# EAGLE design Cansat2019_3279_Container_v02 (EAGLE 7.3.0)
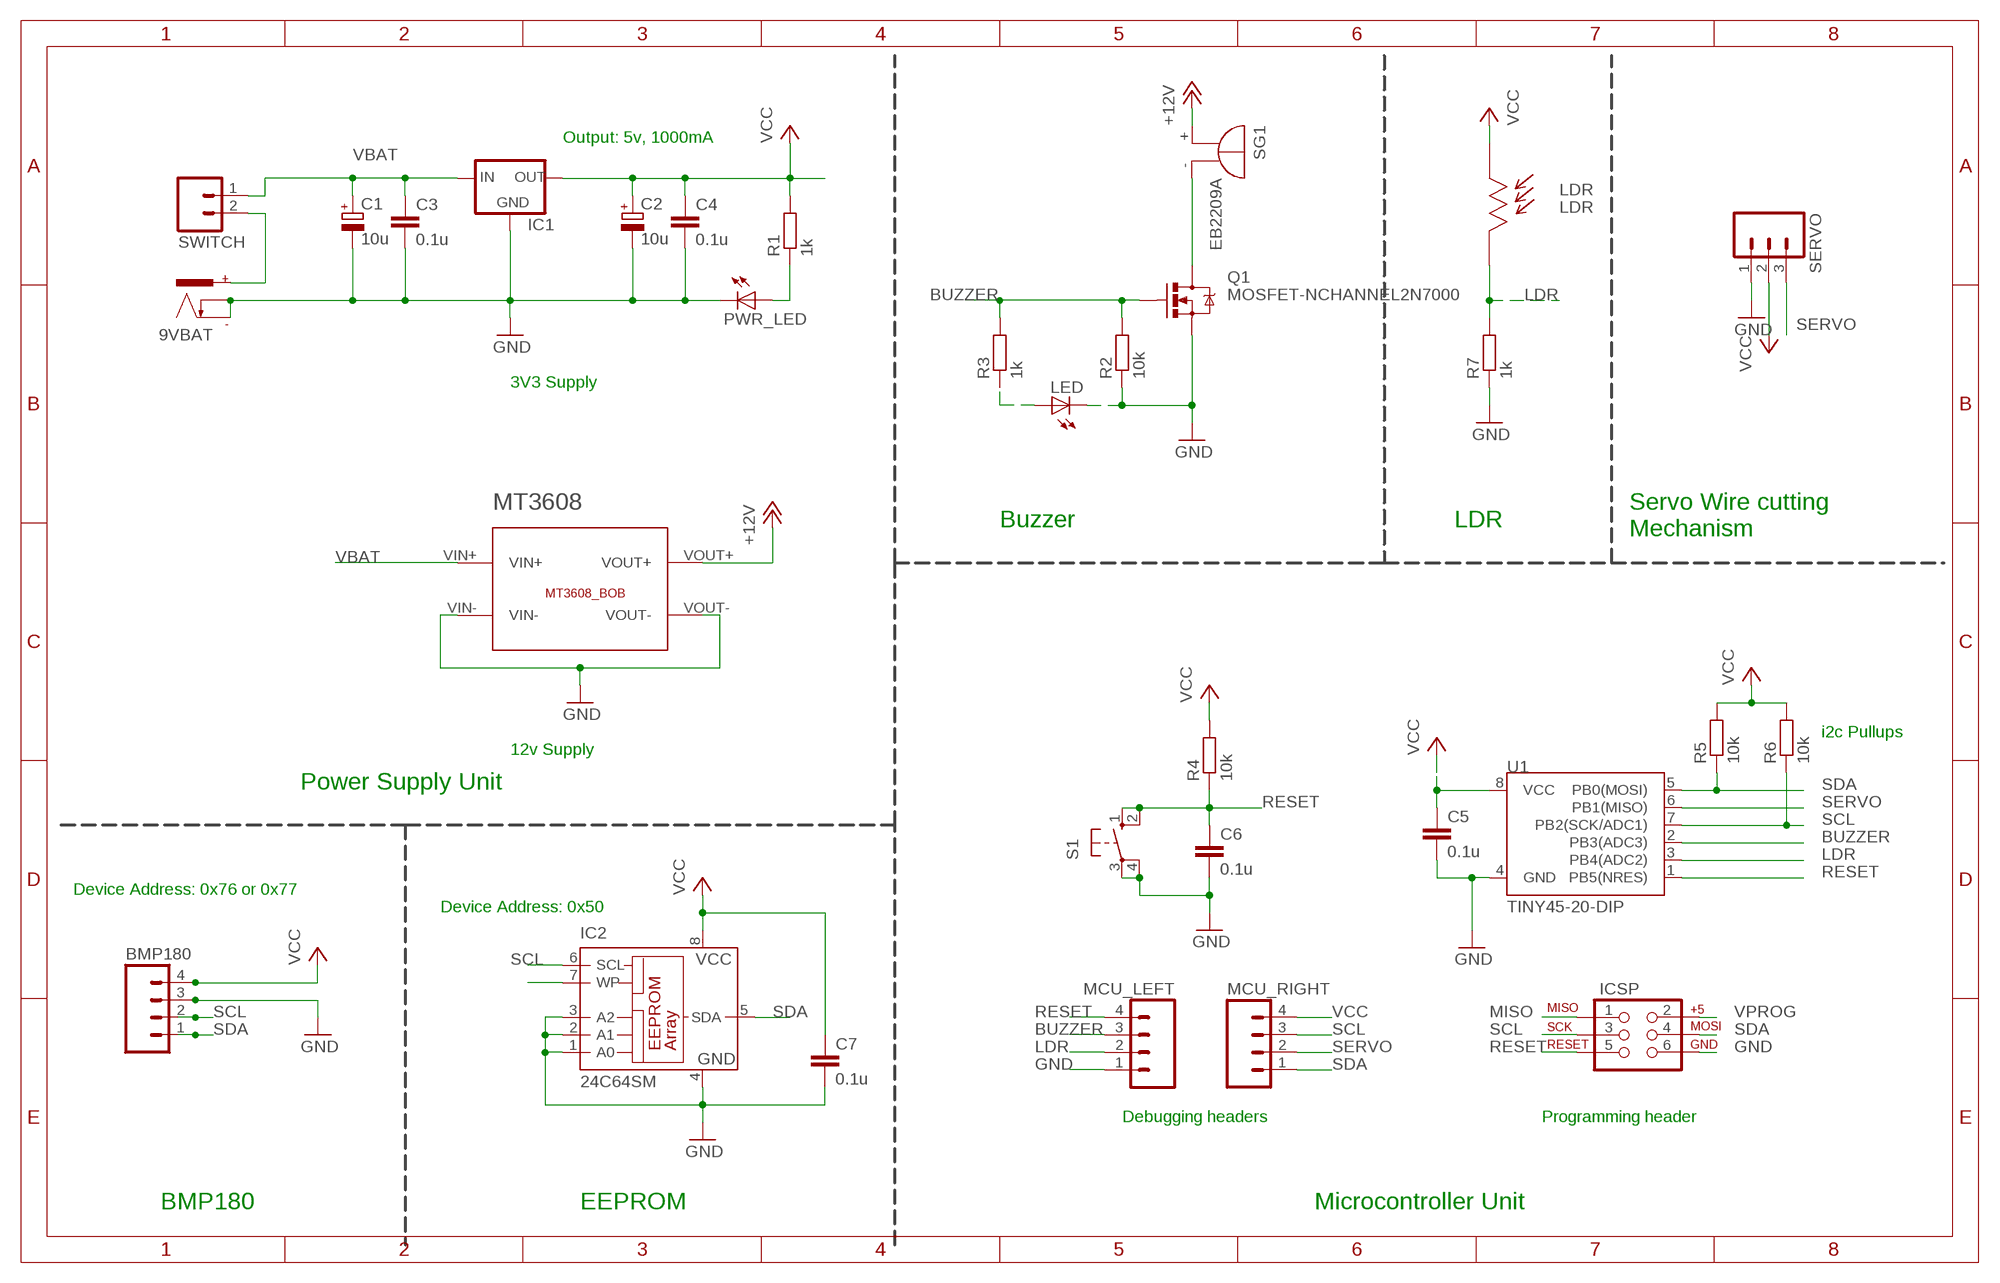
[diagram p0: schematic, sheet 1]

## Parts
9VBAT  POWER_CON  [NEB21R]
BMP180  M04  [04P]
C1  10u  CPOL-EUE2.5-6  [E2,5-6]
C2  10u  CPOL-EUE2.5-6  [E2,5-6]
C3  0.1u  C-EU025-025X050  [C025-025X050]
C4  0.1u  C-EU025-025X050  [C025-025X050]
C5  0.1u  C-EU025-025X050  [C025-025X050]
C6  0.1u  C-EU025-025X050  [C025-025X050]
C7  0.1u  C-EU025-025X050  [C025-025X050]
IC1  V_REG_78XX-TO-220  [TO-220-ALT]
IC2  24C64SM  [SO-08M]
ICSP  AVR_SPI_PRG_6NS  [2X3-NS]
LDR  LDR  [LDR-5MM]
LED  LED3MM  [LED3MM]
MCU_LEFT  M04  [04P]
MCU_RIGHT  M04  [04P]
MT3608  MT3608_BOB  [MT3608_BOB]
PWR_LED  LED3MM  [LED3MM]
Q1  MOSFET-NCHANNEL2N7000  [TO-92]
R1  1k  R-EU_0204/7  [0204/7]
R2  10k  R-EU_0204/7  [0204/7]
R3  1k  R-EU_0204/7  [0204/7]
R4  10k  R-EU_0204/7  [0204/7]
R5  10k  R-EU_0204/7  [0204/7]
R6  10k  R-EU_0204/7  [0204/7]
R7  1k  R-EU_0204/7  [0204/7]
S1  PUSH-BUTTON-6MM  [B3F-10XX]
SERVO  M03  [03P]
SG1  EB2209A  [EB2209A]
SWITCH  M02  [02P]
U1  TINY45-20-DIP  ATTINY45TINY45-20-DIP  [DIP08]

## Nets
+12V [power]: MT3608.VOUT+ SG1.+
BUZZER: MCU_LEFT.3 Q1.2(G) R2.2 R3.2 U1.2(PB3(ADC3))
GND [power]: 9VBAT.- 9VBAT.C BMP180.3 C1.- C2.- C3.2 C4.2 C5.2 C6.2 C7.2 IC1.GND IC2.1(A0) IC2.2(A1) IC2.3(A2) IC2.4(GND) ICSP.6 LED.K(C) MCU_LEFT.1 MT3608.VIN- MT3608.VOUT- PWR_LED.K(C) Q1.1(S) R2.1 R7.1 S1.3(P) S1.4(P1) SERVO.1 U1.4(GND)
LDR: LDR.P$2 MCU_LEFT.2 R7.2 U1.3(PB4(ADC2))
MISO: ICSP.1
N$1 [power]: Q1.3(D) SG1.-
N$2: LED.A R3.1
N$3: PWR_LED.A R1.1
N$6 [burner]: 9VBAT.+ SWITCH.2
N$8: IC2.7(WP)
RESET: C6.1 ICSP.5 MCU_LEFT.4 R4.1 S1.1(S) S1.2(S1) U1.1(PB5(NRES))
SCL: BMP180.2 IC2.6(SCL) ICSP.3 MCU_RIGHT.3 R6.1 U1.7(PB2(SCK/ADC1))
SDA: BMP180.1 IC2.5(SDA) ICSP.4 MCU_RIGHT.1 R5.1 U1.5(PB0(MOSI))
SERVO: MCU_RIGHT.2 SERVO.3 U1.6(PB1(MISO))
VBAT [burner]: C1.+ C3.1 IC1.IN MT3608.VIN+ SWITCH.1
VCC [power]: BMP180.4 C2.+ C4.1 C5.1 C7.1 IC1.OUT IC2.8(VCC) LDR.P$1 MCU_RIGHT.4 R1.2 R4.2 R5.2 R6.2 SERVO.2 U1.8(VCC)
VPROG [power]: ICSP.2

## Notes on the sheet
- Output: 5v, 1000mA
- 3V3 Supply
- Buzzer | LDR
- Servo Wire cutting
  Mechanism
- i2c Pullups
- 12v Supply
- Power Supply Unit
- Device Address: 0x76 or 0x77
- Device Address: 0x50
- Debugging headers | Programming header
- BMP180 | EEPROM | Microcontroller Unit

## Library data of the parts
9VBAT = CEDT_JANUARY_2015_v5:POWER_CON: DC Power Connector
BMP180 MCU_LEFT MCU_RIGHT = con-amp-quick:M04: AMP QUICK CONNECTOR; OC_FARNELL: unknown; OC_NEWARK: unknown
C1 C2 = rcl:CPOL-EU: POLARIZED CAPACITOR, European symbol
C3-C7 = rcl:C-EU: CAPACITOR, European symbol
IC1 = 1 - Jim:V_REG_78XX: Voltage Regulator Standard 7805 5V regulator. IGO (Input Ground Output). Spark Fun Electronics SKU : COM-00107
IC2 = microchip:24*: Serial EEPROM I2C; MF: RAMTRON INTERNATIONAL CORP; MPN: FM24C64-S; OC_FARNELL: 9882685; OC_NEWARK: 98H0189
ICSP = SparkFun-Connectors:AVR_SPI_PRG_6: AVR ISP 6 Pin This is the reduced ISP connector for AVR programming. Common on Arduino. This footprint will take up less PCB space and can be used with a 10-pin to 6-pin adapter such as SKU: BOB-08508 **Special note about "TEST_POINT" package. The stop mask is on the top side, so if you want your programming test points to be on the bottom of your board, make sure to place this package on the bottom side of the board. This also ensure that the orientation to program from the bottom side will be correct.
LDR = msp framework:LDR: Light Dependent Resistor Sunrom Product Page <http://www.sunrom.com/p/ldr-5mm-light-dependent-resistor>; SUNROM: 3190
LED PWR_LED = 01_adafruit:LED: LED OSRAM: - CHIPLED LG R971, LG N971, LY N971, LG Q971, LY Q971, LO R971, LY R971 LH N974, LH R974 LS Q976, LO Q976, LY Q976 LO Q996 - Hyper CHIPLED LW Q18S LB Q993, LB Q99A, LB R99A - SideLED LS A670, LO A670, LY A670, LG A670, LP A670 LB A673, LV A673, LT A673, LW A673 LH A674 LY A675 LS A676, LA A676, LO A676, LY A676, LW A676 LS A679, LY A679, LG A679 - Hyper Micro SIDELED® LS Y876, LA Y876, LO Y876, LY Y876 LT Y87S - SmartLED LW L88C, LW L88S LB L89C, LB L89S, LG L890 LS L89K, LO L89K, LY L89K LS L896, LA L896, LO L896, LY L896 - TOPLED LS T670, LO T670, LY T670, LG T670, LP T670 LSG T670, LSP T670, LSY T670, LOP T670, LYG T670 LG T671, LOG T671, LSG T671 LB T673, LV T673, LT T673, LW T673 LH T674 LS T676, LA T676, LO T676, LY T676, LB T676, LH T676, LSB T676, LW T676 LB T67C, LV T67C, LT T67C, LS T67K, LO T67K, LY T67K, LW E67C LS E67B, LA E67B, LO E67B, LY E67B, LB E67C, LV E67C, LT E67C LW T67C LS T679, LY T679, LG T679 LS T770, LO T770, LY T770, LG T770, LP T770 LB T773, LV T773, LT T773, LW T773 LH T774 LS E675, LA E675, LY E675, LS T675 LS T776, LA T776, LO T776, LY T776, LB T776 LHGB T686 LT T68C, LB T68C - Hyper Mini TOPLED® LB M676 - Mini TOPLED Santana® LG M470 LS M47K, LO M47K, LY M47K Source: http://www.osram.convergy.de/
MT3608 = Breakouts:MT3608_BOB
Q1 = SparkFun-DiscreteSemi:MOSFET-NCHANNEL: Common NMOSFET Parts MFG P/N Store ID Prod ID FDD8780 TRANS-09984 SI7820DN TRANS-11055 FDS6630A IC-08089 2N7002PW TRANS-11151 FQP30N06L COM-10213 TRANS-10060 BSS123LT1G TRANS-08345 BSS138 TRANS-00830 BS170 2N7000
R1-R7 = rcl:R-EU_: RESISTOR, European symbol
S1 = msp framework:PUSH-BUTTON: Tactile Switch Momentary Push to ON switch Omron B3F 10-xx & 40-xx Datasheet <http://www.omron.com/ecb/products/pdf/en-b3f.pdf>; SUNROM: 3951
SERVO = msp framework:M03: AMP QUICK CONNECTOR
SG1 = buzzer:EB2209A: BUZZER Source: Buerklin; OC_FARNELL: unknown; OC_NEWARK: unknown
SWITCH = CEDT_JANUARY_2015_v5:M02: AMP QUICK CONNECTOR
U1 = SparkFun-DigitalIC:ATTINY45: Atmel 8-pin 2/4/8kB flash uC; PROD_ID: IC-09439

## Net classes
0 default: width 0.305 mm, clearance 0.305 mm
1 power: width 0.61 mm, clearance 0.305 mm
2 burner: width 0.813 mm, clearance 0.305 mm

## Board
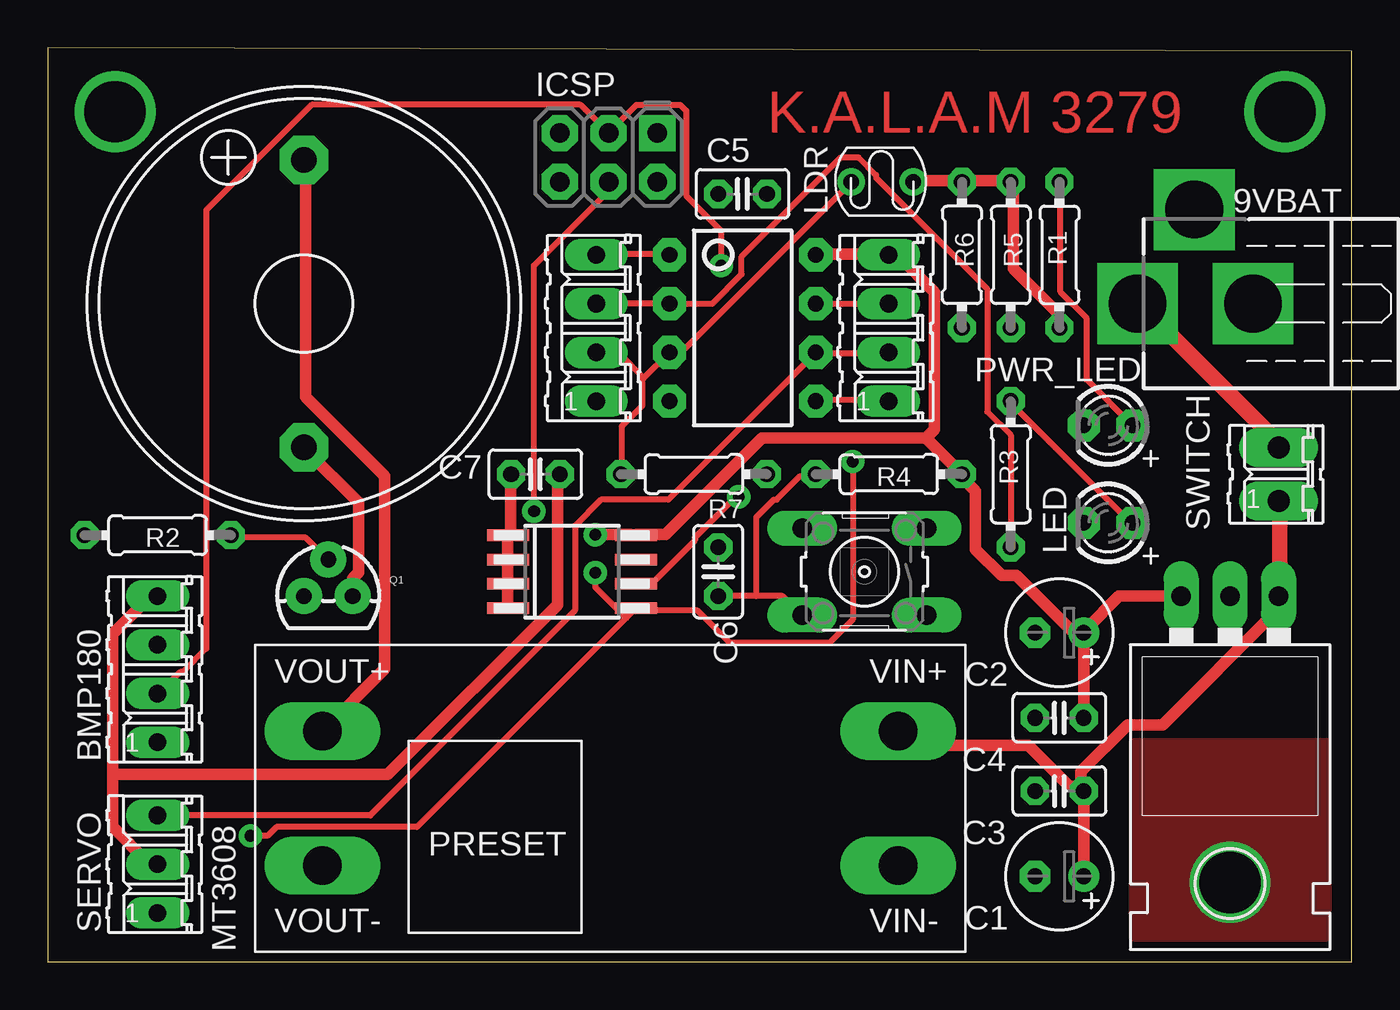
[diagram p1: board, top side]
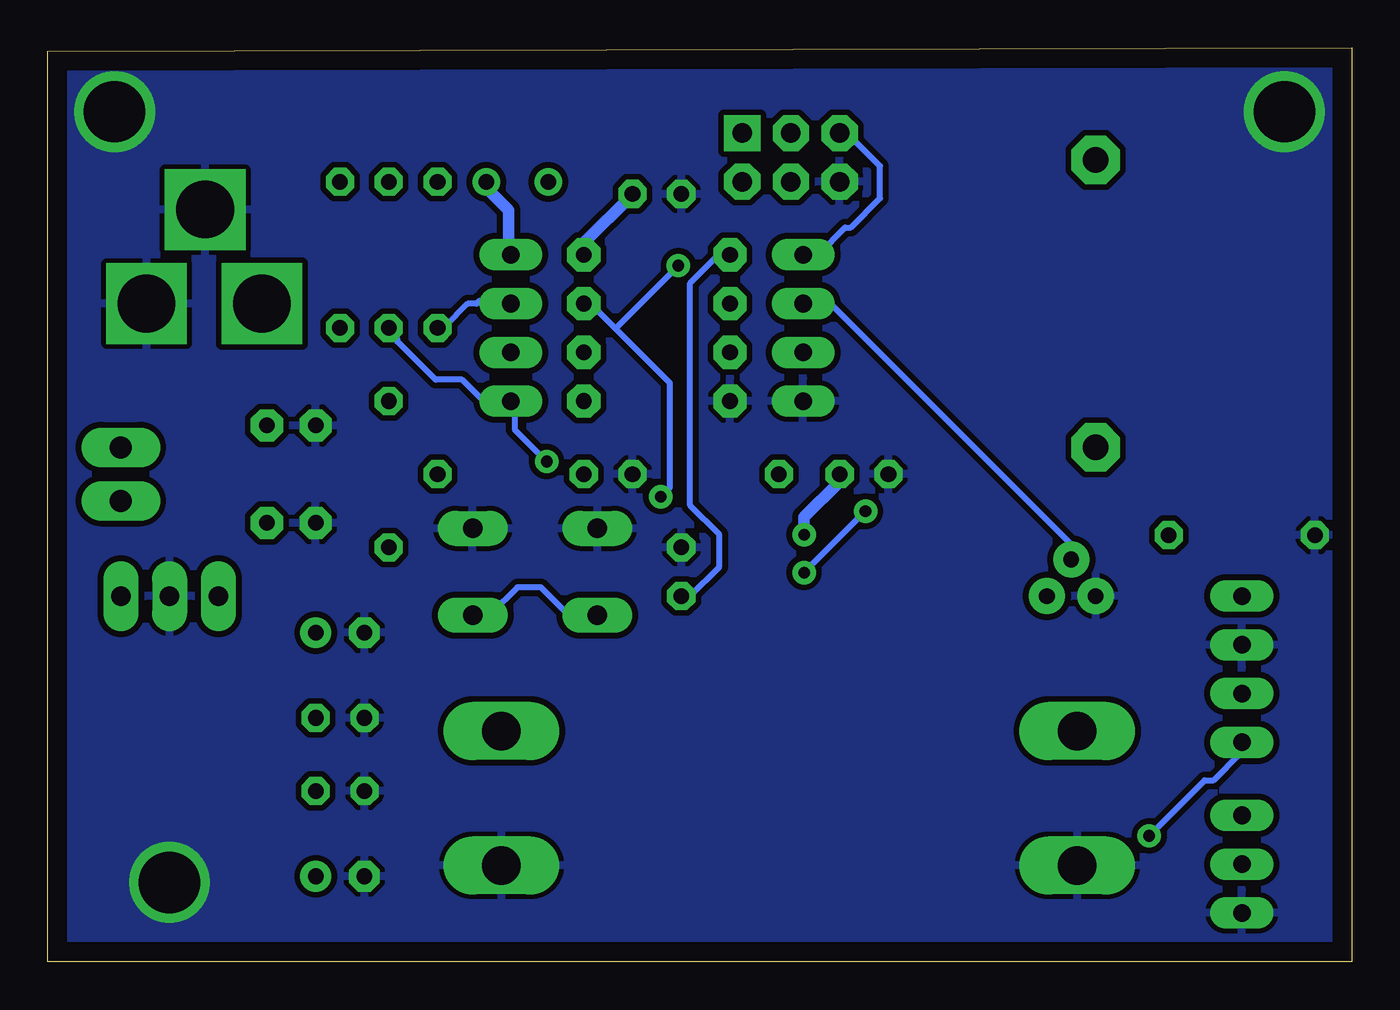
[diagram p2: board, bottom side, seen from below]

Size 67.92 x 47.61 mm. Coordinates in mm from the lower left corner, seen from the top.
Outline: 0,0 67.92,0 67.92,47.45 0,47.61 0,0
Copper layers (1*16): Top 0.035mm / dielectric 1.5mm / Bottom 0.035mm
Design rules "8085_board": minimum track width 10mil, minimum drill 24mil, track to track 8mil, track to pad 8mil, pad to pad 8mil, via to via 8mil, smd to smd 8mil, copper to edge 40mil, drill to drill 8mil, minimum pad ring 12mil, minimum via ring 12mil, stop-mask expansion 4mil, vias tented up to drill 0mil, thermal gap 10mil

### Footprints (pad centres in the part's own frame; a part is rotated, then mirrored left to right if it is on the bottom)
NEB21R = drill 3 pad 4.2 square: + 0,3.54; - 0,-2.46; C 4.9,0.59
04P = drill 0.914 long: 1 -3.81,0; 2 -1.27,0; 3 1.27,0; 4 3.81,0
E2,5-6 = drill 0.813 pad 1.6: + -1.27,0 | drill 0.813 pad 1.6 octagon: - 1.27,0
C025-025X050 = drill 0.813 octagon: 1 -1.27,0; 2 1.27,0
TO-220-ALT = drill 1.016 long: GND 0,-3.81; IN -2.54,-3.81; OUT 2.54,-3.81
SO-08M = smd 0.6 x 2.2: 1 -1.905,-3.33; 2 -0.635,-3.33; 3 0.635,-3.33; 4 1.905,-3.33; 5 1.905,3.33; 6 0.635,3.33; 7 -0.635,3.33; 8 -1.905,3.33
2X3-NS = drill 1.016 pad 1.88 square: 1 -2.54,-1.27 | drill 1.016 pad 1.88 octagon: 2 -2.54,1.27; 3 0,-1.27; 4 0,1.27; 5 2.54,-1.27; 6 2.54,1.27
LDR-5MM = drill 0.8: P$1 0,0; P$2 3.24,0
LED3MM = drill 0.813 pad 1.676 octagon: A -1.27,0; K 1.27,0
MT3608_BOB = drill 2 pad 3 long: VIN+ 33.5,-4.5; VIN- 33.5,-11.5; VOUT+ 3.5,-4.5; VOUT- 3.5,-11.5
TO-92 = drill 0.813 pad 1.88: 1 -1.27,0; 2 0,1.905; 3 1.27,0
0204/7 = drill 0.813 octagon: 1 -3.81,0; 2 3.81,0
B3F-10XX = drill 1.016 long: 1 -3.251,2.261; 2 3.251,2.261; 3 -3.251,-2.261; 4 3.251,-2.261
03P = drill 0.914 long: 1 -2.54,0; 2 0,0; 3 2.54,0
EB2209A = drill 1.321 pad 2.54 octagon: + 7.493,0; - -7.493,0
02P = drill 1.143 long: 1 -1.397,0; 2 1.397,0
DIP08 = drill 0.813 pad 1.727 octagon: 1 -3.81,-3.81; 2 -1.27,-3.81; 3 1.27,-3.81; 4 3.81,-3.81; 5 3.81,3.81; 6 1.27,3.81; 7 -1.27,3.81; 8 -3.81,3.81

### Placement (x,y rotation side)
9VBAT  60.33,34.29 90 top
BMP180  5.71,15.24 90 top
C1  52.7,4.45 180 top
C2  52.7,17.14 180 top
C3  52.7,8.89 180 top
C4  52.7,12.7 180 top
C5  36.2,40.01 180 top
C6  34.92,20.32 90 top
C7  25.4,25.4 180 top
IC1  61.59,15.24 180 top
IC2  27.3,20.32 270 top
ICSP  29.21,41.91 180 top
LDR  45.09,40.64 180 top
LED  55.24,22.86 180 top
MCU_LEFT  28.57,33.02 90 top
MCU_RIGHT  43.81,33.02 90 top
MT3608  10.79,16.51 0 top
PWR_LED  55.24,27.94 180 top
Q1  14.61,19.05 0 top
R1  52.7,36.83 270 top
R2  5.71,22.23 0 top
R3  50.16,25.4 270 top
R4  43.81,25.4 0 top
R5  50.16,36.83 90 top
R6  47.62,36.83 90 top
R7  33.66,25.4 180 top
S1  42.55,20.32 180 top
SERVO  5.71,5.08 90 top
SG1  13.34,34.29 90 top
SWITCH  64.14,25.4 90 top
U1  36.2,33.02 270 top

### Tracks (layer width: path | path; a pad name or v marks a point on that pad's centre or on a via)
+12V
  Top 0.61: SG1.+ 13.44,41.76 13.44,29.41 17.55,25.3 17.55,15.24 14.35,12.04 MT3608.VOUT+
BUZZER
  Top 0.305: R2.2 9.63,22.1 13.44,22.1 14.5,21.03 Q1.2 | R3.2 50.16,27.43 48.95,28.65 48.95,35.05 43.16,40.84 43.16,41 42.24,41.91 41.33,41.91 36.14,36.73 36.14,35.81 34.62,34.29 U1.2 MCU_LEFT.3
  Bottom 0.305: MCU_LEFT.3 27.15,34.29 14.66,21.79 14.66,21.03 Q1.2
GND  (via drill 3.2)
  Top 0.61: IC2.4 23.95,18.44 23.95,19.66 IC2.3 23.95,19.96 23.95,20.88 IC2.2 23.95,21.18 23.95,22.1 IC2.1 24.11,22.4 24.11,25.3 C7.2
  other vias: 64.45,44.29 3.49,44.29 61.59,4.13
  pour Bottom: -1.91,52.07 70.48,52.07 70.48,-1.27 -1.91,-1.27
  pour Top: 56.52,1.27 66.67,1.27 66.67,11.43 56.52,11.43
  pour Bottom: 56.52,1.27 66.67,1.27 66.67,11.43 56.52,11.43
LDR
  Top 0.305: LDR.P$2 41.78,40.54 33.1,31.85 32.49,31.85 U1.3 31.04,30.4 | 31.04,30.4 30.96,30.33 30.96,28.96 29.9,27.89 29.9,25.45 R7.2 | 31.04,30.4 29.74,31.7 28.68,31.7 MCU_LEFT.2
N$1
  Top 0.61: Q1.3 15.88,19.96 16.18,20.27 16.18,23.93 13.44,26.67 SG1.-
N$2
  Top 0.305: R3.1 50.16,29.11 56.41,22.86 LED.A
N$3
  Top 0.305: PWR_LED.A 54.13,30.33 54.13,33.53 52.76,34.9 52.76,40.54 R1.1
N$6
  Top 0.813: SWITCH.2 64.03,26.82 64.03,27.13 56.87,34.29 9VBAT.+
RESET
  Top 0.305: MCU_LEFT.4 28.68,36.88 32.33,36.88 U1.1 | 36.91,19.05 38.28,19.05 39.19,18.14 S1.2 | 36.91,19.05 C6.1 | 36.91,19.05 36.91,23.16 37.82,24.08 37.97,24.08 39.19,25.3 39.95,25.3 R4.1
  Bottom 0.305: ICSP.5 26.54,43.13 26.24,43.13 24.56,41.45 24.56,39.78 26.09,38.25 26.39,38.25 27.76,36.88 28.52,36.88 MCU_LEFT.4 | S1.1 45.74,18.14 44.83,18.14 43.46,19.51 42.24,19.51 40.87,18.14 39.34,18.14 S1.2 | C6.1 34.47,19.05 32.94,20.57 32.94,22.25 34.47,23.77 34.47,35.36 33.1,36.73 32.49,36.73 U1.1
SCL  (via drill 0.61)
  Top 0.305: v35.99,24.23 35.84,24.23 33.71,22.1 33.71,21.95 31.57,19.81 30.66,19.81 IC2.6 | U1.7 MCU_RIGHT.3 | BMP180.2 5.82,14.02 6.88,15.09 7.04,15.09 8.26,16.31 8.26,39.17 13.74,44.65 27.76,44.65 29.13,43.28 ICSP.3 29.29,43.28 30.66,44.65 32.94,44.65 33.25,44.35 33.25,39.93 35.08,38.1 v35.08,36.27
  Bottom 0.305: R6.1 47.57,33.07 47.27,33.07 46.05,34.29 45.59,34.29 45.44,34.44 44.07,34.44 43.92,34.29 MCU_RIGHT.3 | v35.99,24.23 35.53,24.69 35.53,30.18 38.35,32.99 | 38.35,32.99 39.65,34.29 U1.7 | v35.08,36.27 38.35,32.99
SDA  (via drill 0.61)
  Top 0.305: v41.94,26.06 41.94,17.83 40.72,16.61 35.53,16.61 33.86,18.29 30.66,18.29 IC2.5 30.5,18.29 30.12,17.91 | v10.54,6.55 11.46,6.55 11.91,7.01 19.23,7.01 30.12,17.91 | U1.5 40.11,29.26 43.76,29.26 MCU_RIGHT.1 | v25.32,23.47 25.32,36.27 29.13,40.08 29.13,40.54 ICSP.4 | v28.52,20.27 28.52,19.51 30.12,17.91
  Bottom 0.305: v41.94,26.06 43.61,27.74 43.61,28.96 43.76,29.11 MCU_RIGHT.1 43.92,29.26 45.29,29.26 46.35,30.33 47.73,30.33 49.71,32.31 49.71,32.46 50.16,32.92 R5.1 | v10.54,6.55 7.64,9.45 7.19,9.45 5.82,10.82 5.82,11.43 BMP180.1 | v28.52,20.27 v25.32,23.47
SERVO
  Top 0.305: SERVO.3 16.79,7.62 27.46,18.29 27.46,22.71 28.83,24.08 32.33,24.08 U1.6 40.11,31.7 43.76,31.7 MCU_RIGHT.2
VBAT
  Top 0.61: 64.19,19.05 IC1.IN 63.88,18.9 63.88,18.14 58.09,12.34 56.26,12.34 53.82,9.91 53.82,9.45 C3.1 | 64.19,23.93 SWITCH.1 | C1.+ C3.1 | C3.1 53.82,9.14 53.21,9.14 51.08,11.28 44.98,11.28 44.37,11.89 MT3608.VIN+
  Top 0.813: 64.19,23.93 64.19,19.05
VCC  (via drill 0.61)
  Top 0.61: 3.38,9.75 3.38,17.07 5.36,19.05 BMP180.4 | 3.38,9.75 3.38,7.01 5.21,5.18 5.66,5.18 SERVO.2 | LDR.P$1 45.14,40.69 47.57,40.69 R6.2 47.88,40.69 50.16,40.69 R5.2 50.32,40.39 50.32,36.12 52.6,33.83 52.6,33.07 R1.2 | C2.+ C4.1 | IC1.OUT 55.8,19.05 54.13,17.37 C2.+ | U1.8 40.11,36.88 43.76,36.88 MCU_RIGHT.4 44.07,36.73 44.37,36.73 46.2,34.9 46.2,27.74 45.74,27.28 | 45.74,27.28 37.21,27.28 32.18,22.25 30.66,22.25 IC2.8 30.35,22.25 v28.52,22.25 | 45.74,27.28 R4.2 47.73,25.15 48.34,24.54 48.34,21.49 49.71,20.12 50.47,20.12 53.37,17.22 53.67,17.22 C2.+ | 3.38,9.75 17.7,9.75 26.54,18.59 26.54,25.3 C7.1
  Bottom 0.61: C5.1 37.52,39.93 39.95,37.49 39.95,36.88 U1.8 | v28.52,22.25 28.52,23.16 26.7,24.99 26.7,25.3 C7.1 | LDR.P$1 44.98,40.54 44.98,40.23 43.92,39.17 43.92,36.88 MCU_RIGHT.4

### Text on the board
Top: K.A.L.A.M 3279